# EAGLE design badge (EAGLE 5.10)
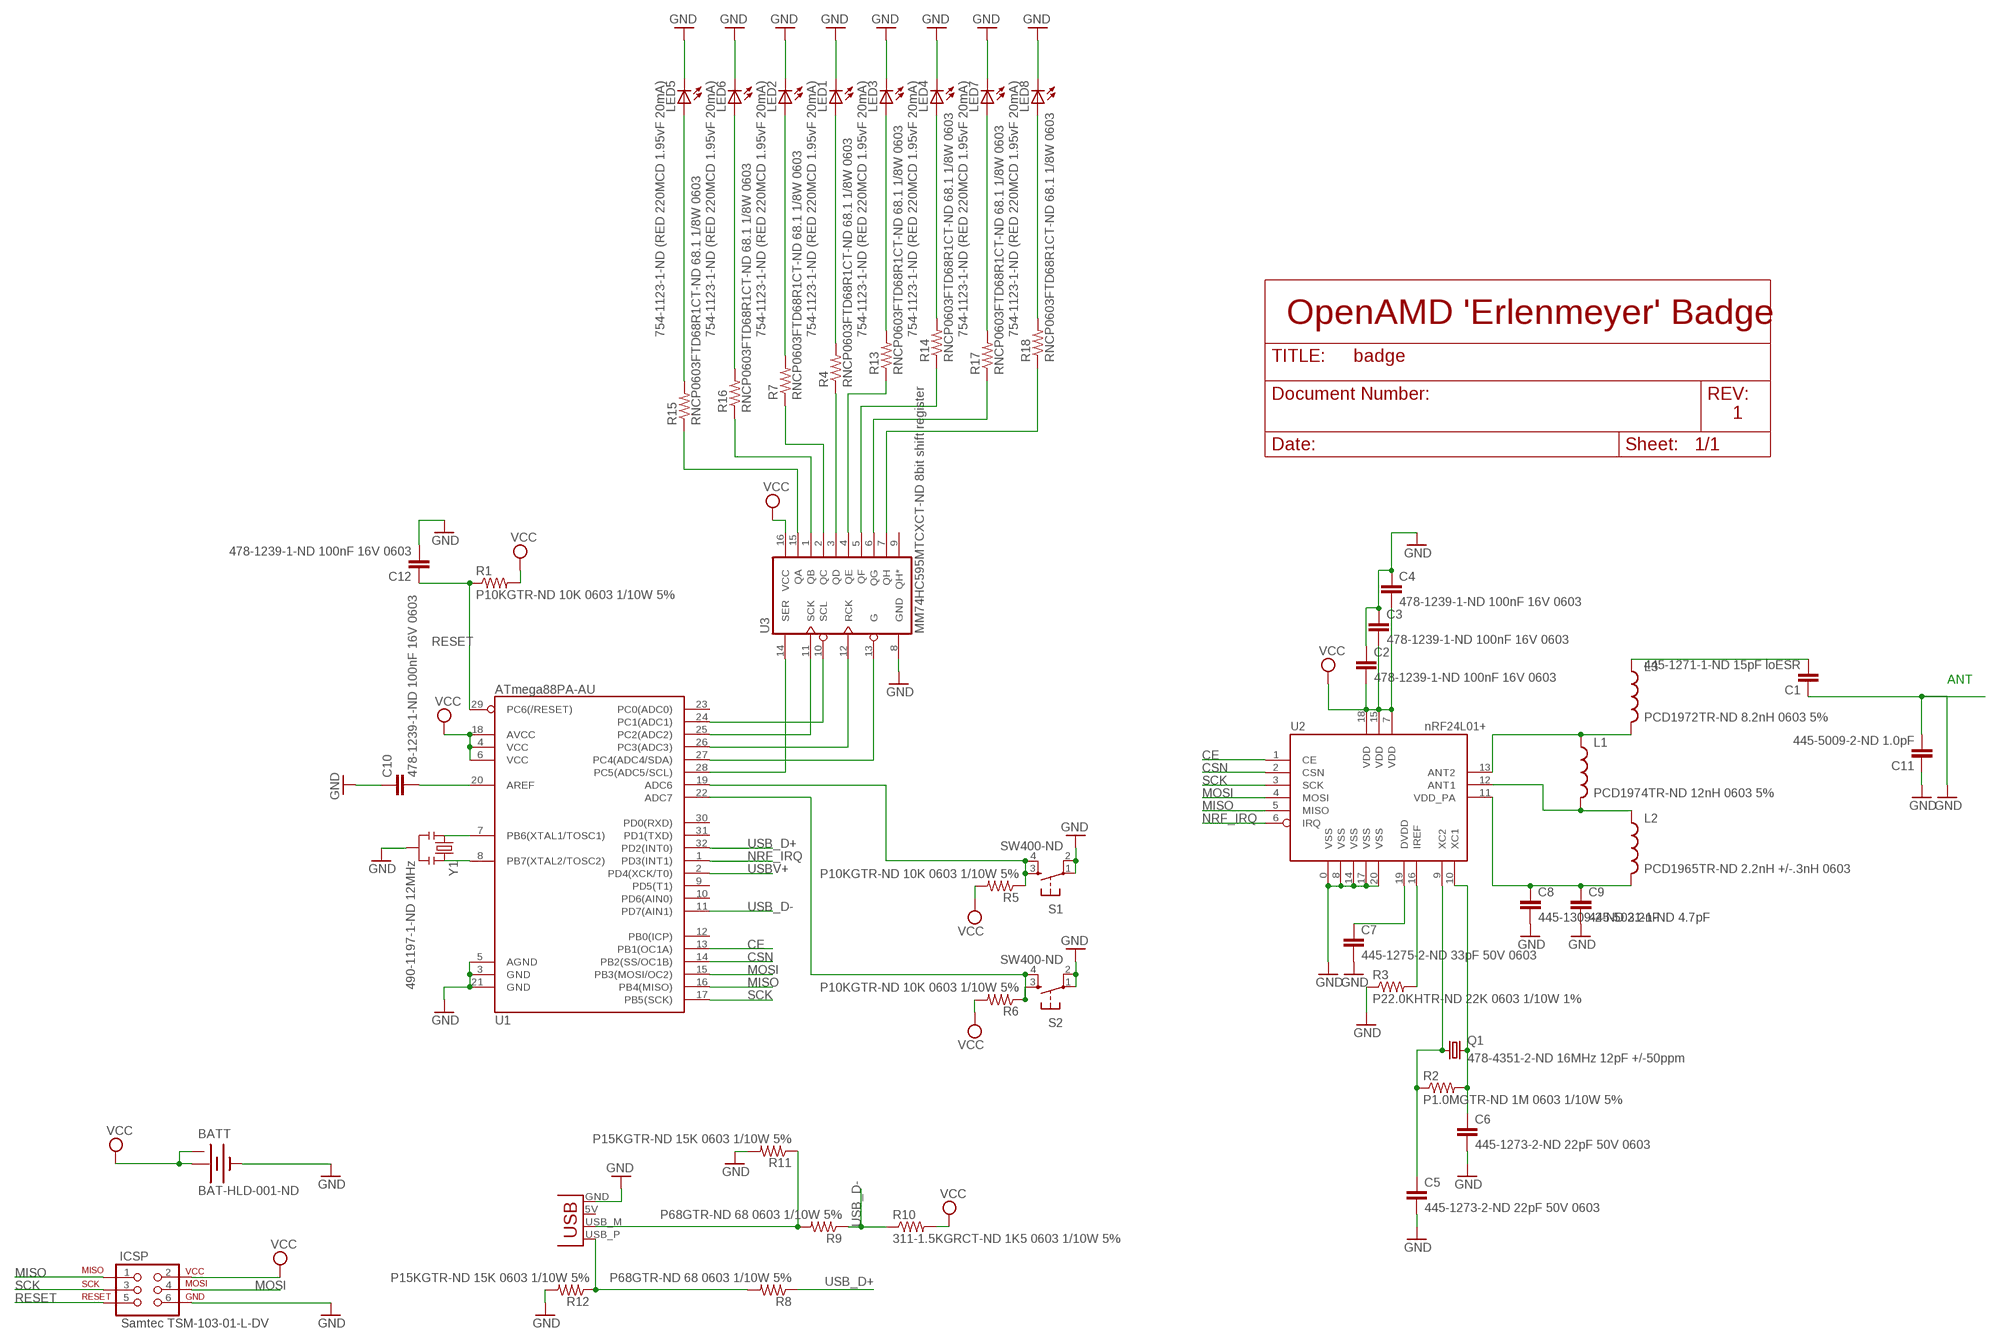
[diagram p0: schematic, sheet 1]

## Parts
BATT  BAT-HLD-001-ND  BATTERY20SMD  [BATTCON_20MM]
C1  445-1271-1-ND 15pF loESR  CAP0603-CAP  [0603-CAP]
C2  478-1239-1-ND 100nF 16V 0603  CAP0603-CAP  [0603-CAP]
C3  478-1239-1-ND 100nF 16V 0603  CAP0603-CAP  [0603-CAP]
C4  478-1239-1-ND 100nF 16V 0603  CAP0603-CAP  [0603-CAP]
C5  445-1273-2-ND 22pF 50V 0603  CAP0603-CAP  [0603-CAP]
C6  445-1273-2-ND 22pF 50V 0603  CAP0603-CAP  [0603-CAP]
C7  445-1275-2-ND 33pF 50V 0603  CAP0603-CAP  [0603-CAP]
C8  445-1309-2-ND 2.2nF  CAP0603-CAP  [0603-CAP]
C9  445-5031-1-ND 4.7pF  CAP0603-CAP  [0603-CAP]
C10  478-1239-1-ND 100nF 16V 0603  CAP0603-CAP  [0603-CAP]
C11  445-5009-2-ND 1.0pF  CAP0603-CAP  [0603-CAP]
C12  478-1239-1-ND 100nF 16V 0603  CAP0603-CAP  [0603-CAP]
ICSP  Samtec TSM-103-01-L-DV  SMT_AVR_PROGRAMMER  [2X5-SHROUDED_SMD]
L1  PCD1974TR-ND 12nH 0603 5%  INDUCTOR0603  [0603]
L2  PCD1965TR-ND 2.2nH +/-.3nH 0603  INDUCTOR0603  [0603]
L3  PCD1972TR-ND 8.2nH 0603 5%  INDUCTOR0603  [0603]
LED1  754-1123-1-ND (RED 220MCD 1.95vF 20mA)  LED0603  [LED-0603]
LED2  754-1123-1-ND (RED 220MCD 1.95vF 20mA)  LED0603  [LED-0603]
LED3  754-1123-1-ND (RED 220MCD 1.95vF 20mA)  LED0603  [LED-0603]
LED4  754-1123-1-ND (RED 220MCD 1.95vF 20mA)  LED0603  [LED-0603]
LED5  754-1123-1-ND (RED 220MCD 1.95vF 20mA)  LED0603  [LED-0603]
LED6  754-1123-1-ND (RED 220MCD 1.95vF 20mA)  LED0603  [LED-0603]
LED7  754-1123-1-ND (RED 220MCD 1.95vF 20mA)  LED0603  [LED-0603]
LED8  754-1123-1-ND (RED 220MCD 1.95vF 20mA)  LED0603  [LED-0603]
Q1  478-4351-2-ND 16MHz 12pF +/-50ppm  CRYSTALSMD  [HC49UP]
R1  P10KGTR-ND 10K 0603 1/10W 5%  RESISTOR0603-RES  [0603-RES]
R2  P1.0MGTR-ND 1M 0603 1/10W 5%  RESISTOR0603-RES  [0603-RES]
R3  P22.0KHTR-ND 22K 0603 1/10W 1%  RESISTOR0603-RES  [0603-RES]
R4  RNCP0603FTD68R1CT-ND 68.1 1/8W 0603  RESISTOR0603-RES  [0603-RES]
R5  P10KGTR-ND 10K 0603 1/10W 5%  RESISTOR0603-RES  [0603-RES]
R6  P10KGTR-ND 10K 0603 1/10W 5%  RESISTOR0603-RES  [0603-RES]
R7  RNCP0603FTD68R1CT-ND 68.1 1/8W 0603  RESISTOR0603-RES  [0603-RES]
R8  P68GTR-ND 68 0603 1/10W 5%  RESISTOR0603-RES  [0603-RES]
R9  P68GTR-ND 68 0603 1/10W 5%  RESISTOR0603-RES  [0603-RES]
R10  311-1.5KGRCT-ND 1K5 0603 1/10W 5%  RESISTOR0603-RES  [0603-RES]
R11  P15KGTR-ND 15K 0603 1/10W 5%  RESISTOR0603-RES  [0603-RES]
R12  P15KGTR-ND 15K 0603 1/10W 5%  RESISTOR0603-RES  [0603-RES]
R13  RNCP0603FTD68R1CT-ND 68.1 1/8W 0603  RESISTOR0603-RES  [0603-RES]
R14  RNCP0603FTD68R1CT-ND 68.1 1/8W 0603  RESISTOR0603-RES  [0603-RES]
R15  RNCP0603FTD68R1CT-ND 68.1 1/8W 0603  RESISTOR0603-RES  [0603-RES]
R16  RNCP0603FTD68R1CT-ND 68.1 1/8W 0603  RESISTOR0603-RES  [0603-RES]
R17  RNCP0603FTD68R1CT-ND 68.1 1/8W 0603  RESISTOR0603-RES  [0603-RES]
R18  RNCP0603FTD68R1CT-ND 68.1 1/8W 0603  RESISTOR0603-RES  [0603-RES]
S1  SW400-ND  TAC_SWITCHSMD  [TACTILE_SWITCH_SMD]
S2  SW400-ND  TAC_SWITCHSMD  [TACTILE_SWITCH_SMD]
U1  ATmega88PA-AU  ATMEGA168  [TQFP32-08]
U2  nRF24L01+  NRF24L01SMD  [QFN20]
U3  MM74HC595MTCXCT-ND 8bit shift register  74595  [TSSOP16]
X2  USBPCB  [USB-A-PCB]
Y1  490-1197-1-ND 12MHz  RESONATORSMD  [RESONATOR-SMD]

## Nets
CE: U1.13(PB1(OC1A)) U2.1(CE)
CSN: U1.14(PB2(SS/OC1B)) U2.2(CSN)
GND: BATT.2(-) C1.1 C2.1 C3.1 C4.1 C5.2 C6.2 C7.2 C8.2 C9.2 C10.1 C11.1 C11.2 C12.2 ICSP.6 LED1.C LED2.C LED3.C LED4.C LED5.C LED6.C LED7.C LED8.C R3.1 R11.2 R12.2 S1.1 S1.2 S2.1 S2.2 U1.3(GND) U1.5(AGND) U1.21(GND) U2.0(VSS) U2.8(VSS) U2.14(VSS) U2.17(VSS) U2.20(VSS) U3.8(GND) X2.GND Y1.2
MISO: ICSP.1 U1.16(PB4(MISO)) U2.5(MISO)
MOSI: ICSP.4 U1.15(PB3(MOSI/OC2)) U2.4(MOSI)
N$1: L1.1 L3.2 U2.13(ANT2)
N$2: L1.2 L2.1 U2.12(ANT1)
N$3: C8.1 C9.1 L2.2 U2.11(VDD_PA)
N$4: R5.1 S1.3 S1.4 U1.19(ADC6)
N$5: R6.1 S2.3 S2.4 U1.22(ADC7)
N$6: R3.2 U2.16(IREF)
N$7: C1.2 L3.1
N$8: C5.1 Q1.1 R2.1 U2.9(XC2)
N$9: C6.1 Q1.2 R2.2 U2.10(XC1)
N$10: C7.1 U2.19(DVDD)
N$11: R9.2 R11.1 X2.USB_M(D-)
N$12: LED2.A R7.2
N$13: LED1.A R4.2
N$14: U1.7(PB6(XTAL1/TOSC1)) Y1.1
N$15: U1.24(PC1(ADC1)) U3.10(SCL)
N$16: U1.26(PC3(ADC3)) U3.12(RCK)
N$17: U1.8(PB7(XTAL2/TOSC2)) Y1.3
N$18: R8.2 R12.1 X2.USB_P(D+)
N$19: LED3.A R13.2
N$20: U1.27(PC4(ADC4/SDA)) U3.13(G)
N$21: LED4.A R14.2
N$23: LED5.A R15.2
N$24: U1.28(PC5(ADC5/SCL)) U3.14(SER)
N$25: LED6.A R16.2
N$26: U1.25(PC2(ADC2)) U3.11(SCK)
N$32: C10.2 U1.20(AREF)
N$33: R15.1 U3.15(QA)
N$34: R16.1 U3.1(QB)
N$35: R7.1 U3.2(QC)
N$36: R4.1 U3.3(QD)
N$37: R13.1 U3.4(QE)
N$38: R14.1 U3.5(QF)
N$39: LED7.A R17.2
N$40: LED8.A R18.2
N$41: R18.1 U3.7(QH)
N$42: R17.1 U3.6(QG)
NRF_IRQ: U1.1(PD3(INT1)) U2.6(IRQ)
RESET: C12.1 ICSP.5 R1.1 U1.29(PC6(/RESET))
SCK: ICSP.3 U1.17(PB5(SCK)) U2.3(SCK)
USB_D+: R8.1 U1.32(PD2(INT0))
USB_D-: R9.1 R10.1 U1.11(PD7(AIN1))
USBV+: U1.2(PD4(XCK/T0))
VCC: BATT.1(+) BATT.3(+1) C2.2 C3.2 C4.2 ICSP.2 R1.2 R5.2 R6.2 R10.2 U1.4(VCC) U1.6(VCC) U1.18(AVCC) U2.7(VDD) U2.15(VDD) U2.18(VDD) U3.16(VCC)
Unconnected: U1.9(PD5(T1)) U1.10(PD6(AIN0)) U1.12(PB0(ICP)) U1.23(PC0(ADC0)) U1.30(PD0(RXD)) U1.31(PD1(TXD)) U3.9(QH*) X2.5V(VBUS)

## Notes on the sheet
- OpenAMD 'Erlenmeyer' Badge
- 1
- ANT

## Library data of the parts
BATT = cccamd:BATTERY: Battery Holders Various common sizes : AA, AAA, 20mm coin cell and 12mm coin cell.
C1-C12 = SparkFun:CAP: Capacitor Standard 0603 ceramic capacitor, and 0.1" leaded capacitor.
ICSP = cccamd:SMT_AVR_PROGRAMMER
L1-L3 = SparkFun:INDUCTOR: Inductors Basic Inductor/Choke - 0603 and 1206. Footprints are not proven and vary greatly between part numbers.
LED1-LED8 = SparkFun:LED: LEDs Standard schematic elements and footprints for 5mm, 3mm, 1206, and 0603 sized LEDs. 5mm - Spark Fun Electronics SKU : COM-00529 (and others)
Q1 = SparkFun:CRYSTAL: Crystals Various standard crystals. Proven footprints. Spark Fun Electronics SKU : COM-00534
R1-R18 = SparkFun:RESISTOR: Resistor Basic schematic elements and footprints for 0603, 1206, and PTH resistors.
S1 S2 = SparkFun:TAC_SWITCH: Momentary Switch Button commonly used for reset or general input. Spark Fun Electronics SKU : COM-00097
U1 = SparkFun:ATMEGA168
U2 = SparkFun:NRF24L01: 2.4GHz Low Power Transceiver This is the very popular, low cost, very low power RF transceiver from Nordic Semiconductor. Simple SPI interface. SKU: COM-00690
U3 = SparkFun:74*595: 8-bit SHIFT REGISTER, output latch
X2 = SparkFun:USB: USB Connectors USB-B-PTH is fully proven SKU : PRT-00139 USB-miniB is fully proven SKU : PRT-00587 USB-A-PCB is untested. USB-A-H is throughly reviewed, but untested. Spark Fun Electronics SKU : PRT-00437 USB-B-SMT is throughly reviewed, but untested. Needs silkscreen touching up. USB-A-S has not been used/tested USB-MB-H has not been used/tested
Y1 = SparkFun:RESONATOR: Resonator Small SMD resonator. This is the itty bitty 10/20MHz resonators with built in caps. CSTCE10M0G55 and CSTCE20M0V53. Footprint has been reviewed closely but hasn't been tested yet.

## Board
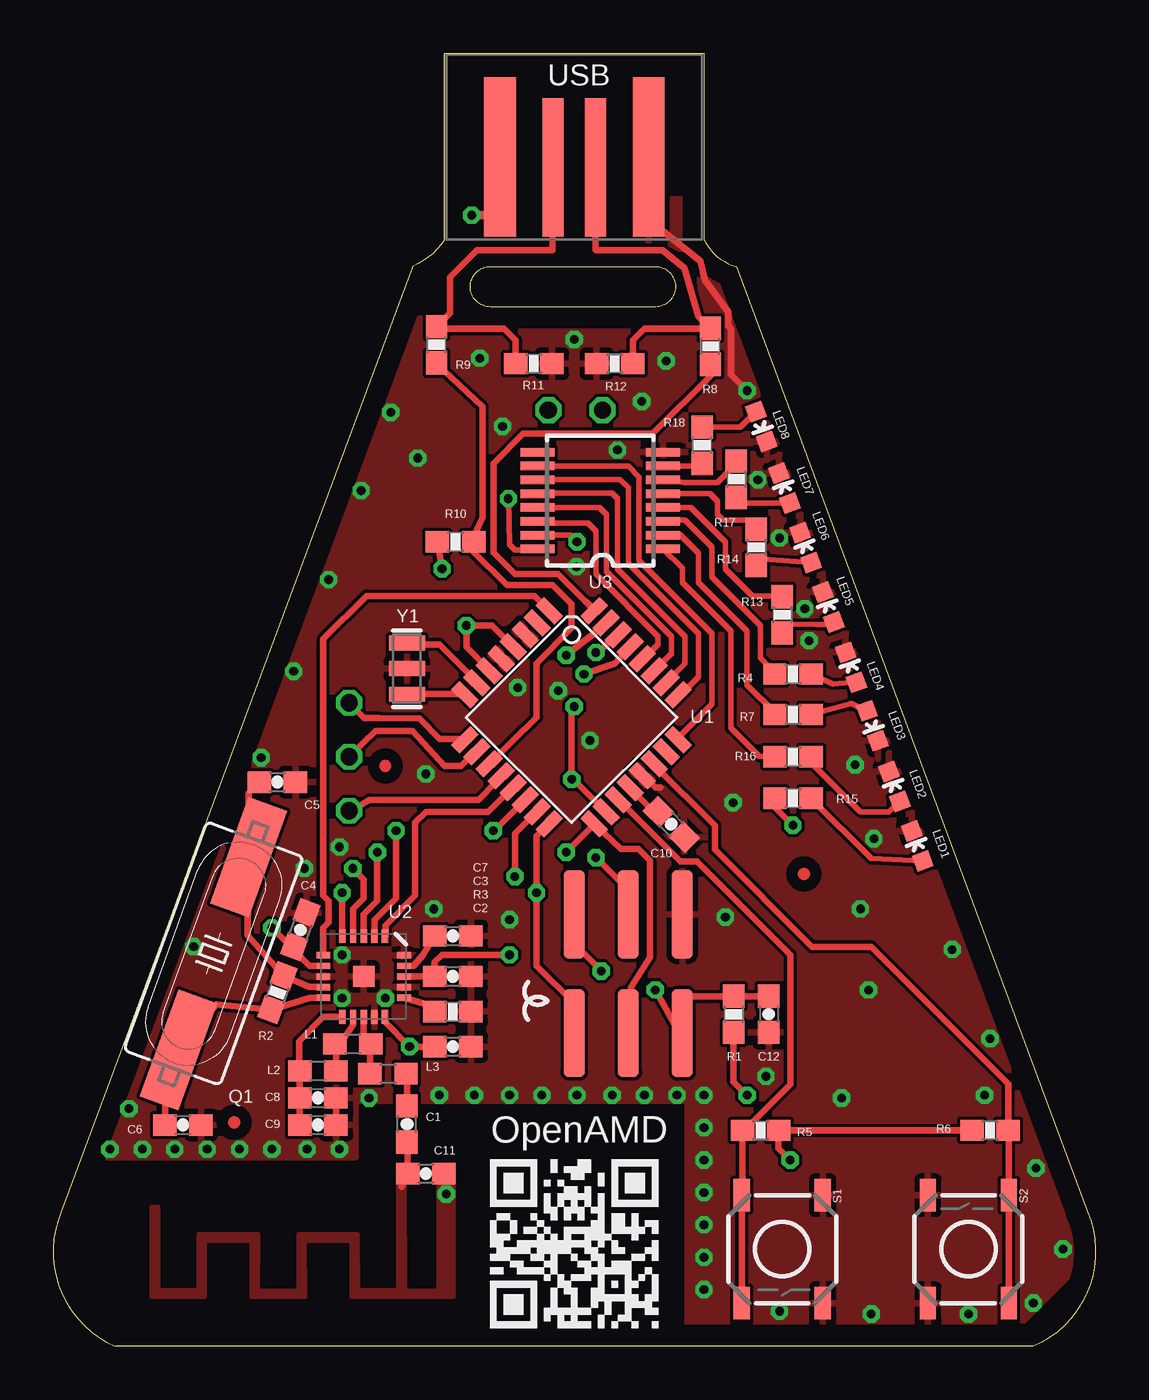
[diagram p1: board, top side]
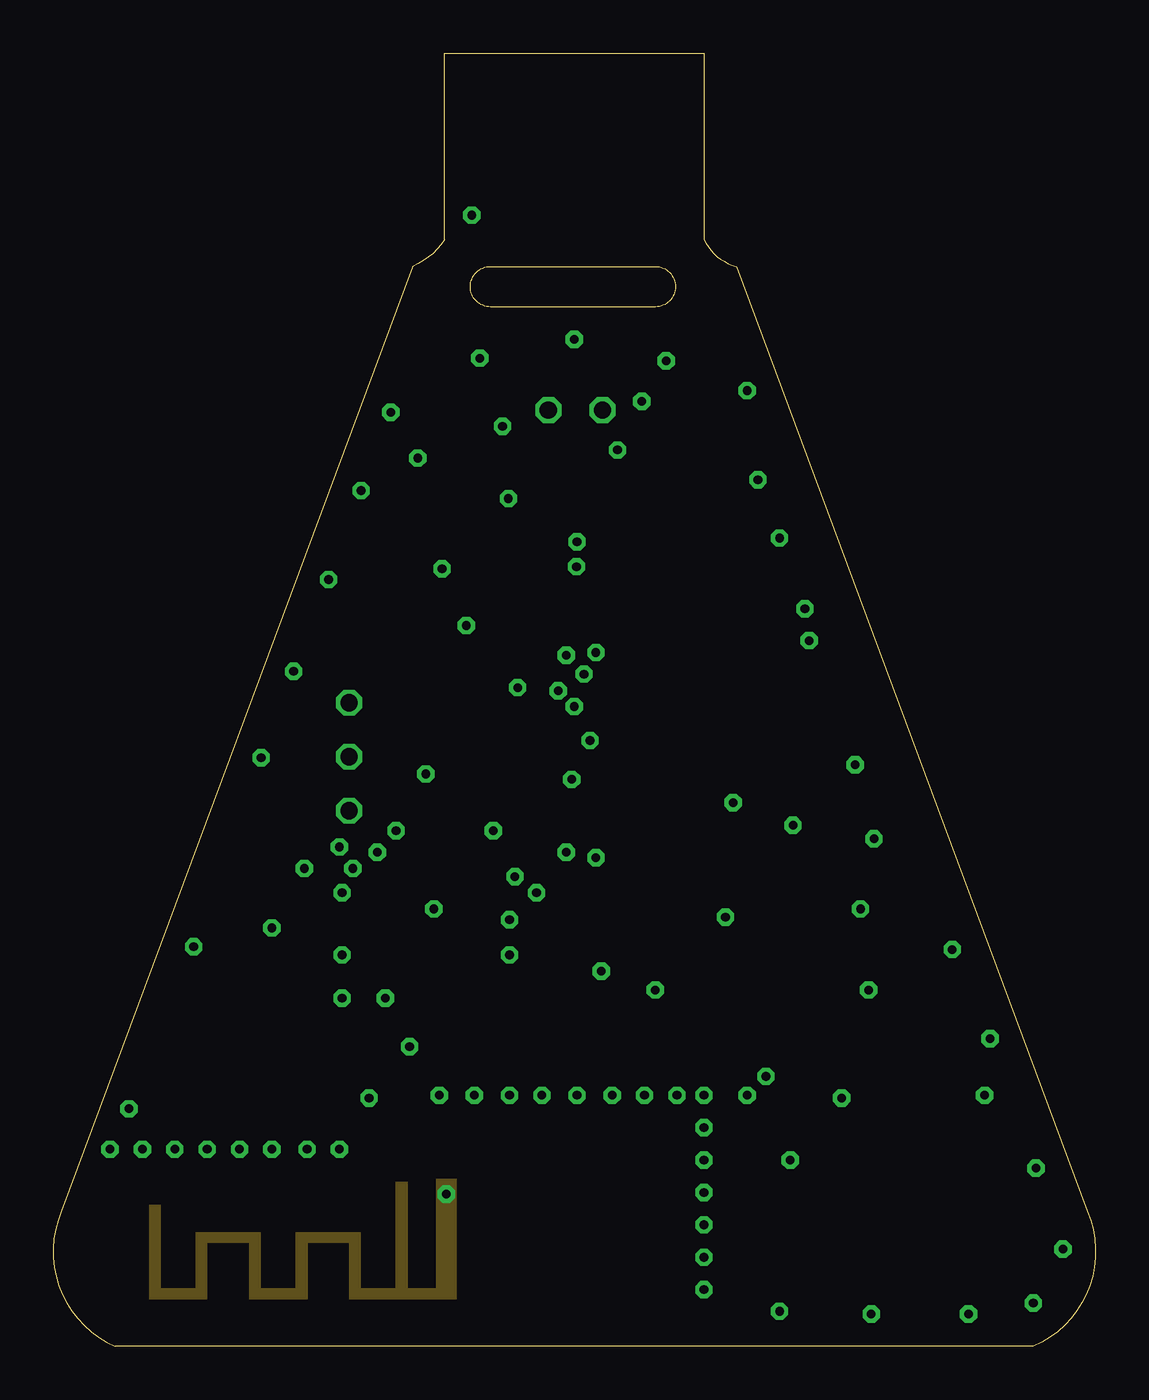
[diagram p2: board, inner layer NotUsed]
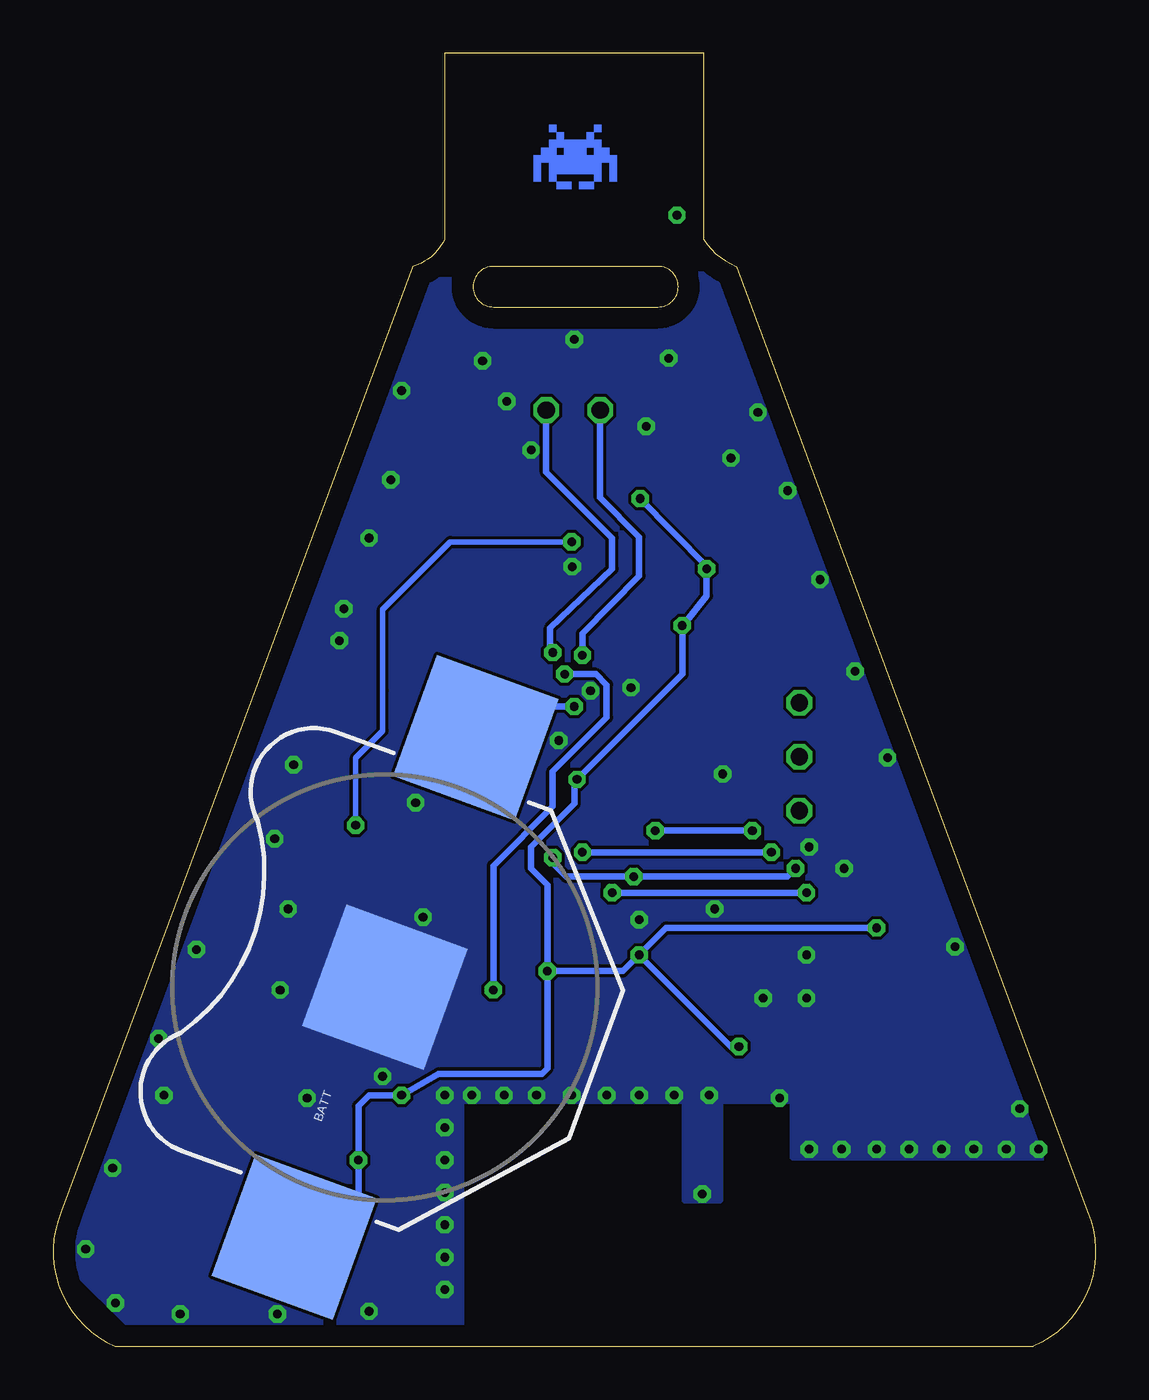
[diagram p3: board, bottom side, seen from below]

Size 49.04 x 60.83 mm. Coordinates in mm from the lower left corner, seen from the top.
Outline: 28.33,50.8 arc-180 28.33,48.9 20.58,48.9 arc-180 20.58,50.8 28.33,50.8
Outline: 18.42,52.07 18.42,60.83 30.61,60.83 30.61,52.07 arc49 32.14,50.8 48.65,6.35 arc-90 46.11,0 2.93,0 arc-90 0.39,6.35 16.9,50.8 arc36 18.42,52.07
Copper layers (1*16): Top 0.035mm / dielectric 1.5mm / Bottom 0.035mm
Design rules "default *": minimum track width 10mil, minimum drill 24mil, track to track 6mil, track to pad 6mil, pad to pad 6mil, via to via 8mil, smd to smd 6mil, copper to edge 40mil, drill to drill 8mil, minimum pad ring 10mil, minimum via ring 8mil, stop-mask expansion 4mil, vias tented up to drill 20mil, thermal gap 10mil
tRestrict: area 15.1,26.7 to 16.2,27.9; area 7.9,10 to 9.1,11.1; area 34.7,21.7 to 35.9,22.8

### Footprints (pad centres in the part's own frame; a part is rotated, then mirrored left to right if it is on the bottom)
BATTCON_20MM = smd 6.07 x 6.07: 1 -12.5,0; 2 0,0; 3 12.5,0
0603-CAP = smd 1.1 x 1: 1 -0.85,0; 2 0.85,0
2X5-SHROUDED_SMD = smd 4.15 x 1: 1 -2.794,2.54; 2 2.794,2.54; 3 -2.794,0; 4 2.794,0; 5 -2.794,-2.54; 6 2.794,-2.54
0603 = smd 1.1 x 1: 1 -0.85,0; 2 0.85,0
LED-0603 = smd 0.8 x 0.8: A 0,-0.75; C 0,0.75
HC49UP = smd 5.334 x 1.93: 1 -4.826,0; 2 4.826,0
0603-RES = smd 1.1 x 1: 1 -0.85,0; 2 0.85,0
TACTILE_SWITCH_SMD = smd 1.524 x 0.762: 1 -2.54,1.905; 2 2.54,1.905; 3 -2.54,-1.905; 4 2.54,-1.905
TQFP32-08 = smd 1.27 x 0.559: 1 -4.293,2.8; 2 -4.293,2; 3 -4.293,1.2; 4 -4.293,0.4; 5 -4.293,-0.4; 6 -4.293,-1.2; 7 -4.293,-2; 8 -4.293,-2.8; 17 4.293,-2.8; 18 4.293,-2; 19 4.293,-1.2; 20 4.293,-0.4; 21 4.293,0.4; 22 4.293,1.2; 23 4.293,2; 24 4.293,2.8 | smd 0.559 x 1.27: 9 -2.8,-4.293; 10 -2,-4.293; 11 -1.2,-4.293; 12 -0.4,-4.293; 13 0.4,-4.293; 14 1.2,-4.293; 15 2,-4.293; 16 2.8,-4.293; 25 2.8,4.293; 26 2,4.293; 27 1.2,4.293; 28 0.4,4.293; 29 -0.4,4.293; 30 -1.2,4.293; 31 -2,4.293; 32 -2.8,4.293
QFN20 = smd 1 x 1: 0 0,0 | smd 0.65 x 0.3: 1 -1.9,1; 2 -1.9,0.5; 3 -1.9,0; 4 -1.9,-0.5; 5 -1.9,-1; 11 1.9,-1; 12 1.9,-0.5; 13 1.9,0; 14 1.9,0.5; 15 1.9,1 | smd 0.3 x 0.65: 6 -1,-1.9; 7 -0.5,-1.9; 8 0,-1.9; 9 0.5,-1.9; 10 1,-1.9; 16 1,1.9; 17 0.5,1.9; 18 0,1.9; 19 -0.5,1.9; 20 -1,1.9
TSSOP16 = smd 0.4 x 1.6: 1 -2.225,-2.85; 2 -1.575,-2.85; 3 -0.925,-2.85; 4 -0.275,-2.85; 5 0.375,-2.85; 6 1.025,-2.85; 7 1.675,-2.85; 8 2.325,-2.85; 9 2.325,3.05; 10 1.675,3.05; 11 1.025,3.05; 12 0.375,3.05; 13 -0.275,3.05; 14 -0.925,3.05; 15 -1.575,3.05; 16 -2.225,3.05
USB-A-PCB = smd 7.5 x 1.5: 5V -0.2,-3.5; GND -0.2,3.5 | smd 6.5 x 1: USB_M 0.3,-1; USB_P 0.3,1
RESONATOR-SMD = smd 0.7 x 1.7: 1 -1.2,0; 2 0,0; 3 1.2,0

### Placement (x,y rotation side)
BATT  33.42,16.89 70 bottom
C1  16.64,10.46 90 top
C2  18.8,14.1 180 top
C3  18.8,17.4 180 top
C4  11.63,19.6 250 top
C5  10.55,26.54 0 top
C6  6.1,10.41 0 top
C7  18.8,19.3 0 top
C8  12.45,11.68 0 top
C9  12.45,10.41 0 top
C10  29.08,24.56 135 top
C11  17.53,8.13 180 top
C12  33.66,15.62 270 top
ICSP  27.06,17.53 90 top
L1  14.1,14.22 180 top
L2  12.45,12.95 180 top
L3  15.76,12.83 180 top
LED1  37.54,31.95 20 top
LED2  38.54,29.19 200 top
LED3  36.47,34.78 20 top
LED4  35.4,37.58 20 top
LED5  40.65,23.54 20 top
LED6  39.57,26.34 20 top
LED7  34.4,40.37 20 top
LED8  33.31,43.27 200 top
Q1  7.54,18.48 250 top
R1  32.01,15.62 270 top
R2  10.55,16.64 250 top
R3  18.8,15.75 180 top
R4  34.81,31.62 0 top
R5  33.28,10.16 0 top
R6  44.08,10.16 180 top
R7  34.81,29.72 0 top
R8  30.92,47.04 90 top
R9  18.04,47.12 90 top
R10  18.93,37.85 180 top
R11  22.61,46.23 0 top
R12  26.42,46.23 180 top
R13  34.3,34.42 270 top
R14  33.08,37.59 270 top
R15  34.81,25.78 0 top
R16  34.81,27.74 0 top
R17  32.14,40.79 270 top
R18  30.54,42.39 90 top
S1  34.3,4.57 270 top
S2  43.06,4.57 90 top
U1  24.39,29.59 315 top
U2  14.61,17.4 270 top
U3  25.84,39.73 90 top
X2  24.52,55.75 270 top
Y1  16.64,31.88 270 top

### Tracks (layer width: path | path; a pad name or v marks a point on that pad's centre or on a via)
CE
  Top 0.305: U1.13 21.58,26.27 20.45,25.15 17.53,25.15 17.03,24.64 17.03,21.21 15.63,19.81 15.63,19.32 U2.1
CSN  (via drill 0.41)
  Top 0.305: 22.16,25.71 U1.14 20.75,24.26 v20.71,24.26 | U2.2 15.11,20.06 16.14,21.08 v16.14,24.26
  Bottom 0.305: v16.14,24.26 v20.71,24.26
GND  (via drill 0.41)
  Top 0.305: C11.1 18.51,8.13 | C1.1 16.68,9.44 C11.2 16.64,8.13 16.39,7.49 | C9.2 C8.2 | X2.GND 28.32,52.76 30.45,51.05 30.65,50.15 31.76,48.64 31.76,48.01 31.88,47.88 31.88,45.72 v32.65,44.96 | 28.58,26.29 28.33,26.29 28.07,26.54 28.01,26.54 U1.21
  other vias: 18.5,7.16 26.3,11.81 27.82,11.81 8.77,9.27 7.25,9.27 5.72,9.27 4.2,9.27 2.67,9.27 3.56,11.18 38.36,16.76 6.61,18.8 37.98,20.57 9.79,27.69 11.31,31.75 12.96,36.07 14.49,40.26 15.88,43.94 20.07,46.48 21.14,43.28 27.69,44.45 28.84,46.36 24.52,47.37 13.6,16.38 13.6,18.41 15.63,16.38 17.91,20.57 19.82,11.81 24.65,11.81 21.85,30.99 37.09,11.68 26.55,42.16 38.62,23.88 42.3,18.67 44.08,14.48 46.24,8.38 47.51,4.57 46.11,2.03 30.61,2.67 30.61,4.19 30.61,5.71 30.61,7.24 30.61,8.76 30.61,10.29 29.34,11.81 37.73,27.36 35.57,33.2 31.99,25.58 35.36,34.7 34.17,38.02 31.63,20.19 21.47,20.07 43.82,11.81 17.15,41.78 34.17,1.65 43.06,1.52 38.49,1.52 33.15,40.77 11.82,22.48 17.53,26.92 13.47,23.5 21.47,11.81 22.99,11.81 18.17,11.81 10.29,9.27 33.54,12.7 11.95,9.27 13.47,9.27 14.87,11.68 30.61,11.81 24.62,36.68 25.25,28.5 23.76,30.84
  pour Top (no thermals): 16.54,7.75 16.56,2.62 18.14,2.63 18.14,7.92 18.84,7.87 18.84,2.32 14.04,2.32 14.05,4.97 11.84,4.97 11.84,2.32 9.34,2.33 9.35,4.97 7.13,4.97 7.13,2.32 4.64,2.32 4.64,6.57 4.93,6.57 4.93,2.63 6.84,2.64 6.84,5.27 9.63,5.27 9.63,2.62 11.54,2.64 11.54,5.27 14.33,5.27 14.34,2.63 16.23,2.63 16.24,7.75
  pour Top (isolate 0.102): 1.66,8.89 14.23,8.89 14.23,11.56 29.85,11.56 29.85,0.64 45.09,0.64 48.39,3.94 31.88,50.17 30.11,50.17 30.11,53.98 27.31,53.98 27.31,51.56 18.8,51.56 17.28,50.04
  pour Bottom (no thermals): 1.66,8.89 14.23,8.89 14.23,11.56 17.66,11.56 17.66,6.86 19.31,6.86 19.31,11.56 29.85,11.56 29.85,0.64 45.09,0.64 48.39,3.94 31.88,50.17 30.11,50.17 30.11,53.98 27.31,53.98 27.31,51.56 18.8,51.56 17.28,50.04
  pour NotUsed (no thermals): 16.64,7.75 16.64,2.73 18.04,2.73 18.04,7.87 18.94,7.87 18.94,2.22 13.94,2.22 13.94,4.86 11.95,4.86 11.95,2.22 9.24,2.22 9.24,4.86 7.23,4.86 7.23,2.22 4.54,2.22 4.54,6.67 5.04,6.67 5.04,2.73 6.74,2.73 6.74,5.37 9.74,5.37 9.74,2.73 11.44,2.73 11.44,5.37 14.43,5.37 14.43,2.73 16.14,2.73 16.14,7.75
MISO  (via drill 0.41)
  Top 0.305: U1.16 23.31,24.58 22.74,24 v22.74,21.34 22.74,17.91 24.52,16.13 ICSP.1 | v13.6,21.34 13.6,19.32 U2.5
  Bottom 0.305: v13.6,21.34 v22.74,21.34
MOSI  (via drill 0.41)
  Top 0.305: U1.15 22.74,25.14 21.72,24.13 v21.72,22.1 | v14.1,22.48 14.61,21.97 14.61,21.08 14.1,20.57 U2.4 | ICSP.4 27.06,21.46 v25.53,22.99
  Bottom 0.305: v14.1,22.48 14.49,22.1 v21.72,22.1 24.9,22.1 25.53,22.73 v25.53,22.99
N$1
  Top 0.305: U2.13 14.61,14.1 L1.1 14.91,13.72 L3.2
N$2
  Top 0.305: U2.12 14.1,15.11 13.25,13.88 L1.2 13.3,13.67 L2.1
N$3
  Top 0.305: U2.11 12.71,15.5 11.56,14.35 11.56,12.48 L2.2 C8.1 C9.1
N$4
  Top 0.305: U1.19 26.62,25.71 29.52,22.81 30.28,22.81 34.68,18.41 34.68,12.32 32.65,10.29 32.77,10.5 R5.1 32.43,7.15 S1.3 S1.4
N$5
  Top 0.305: U1.22 28.28,27.36 31.12,24.51 31.12,23.37 35.69,18.8 38.49,18.8 44.93,12.36 R6.1 44.97,10.12 S2.4 S2.3
N$6
  Top 0.305: R3.2 17.79,16 17.41,16.13 16.53,16.38 U2.16
N$7
  Top 0.305: L3.1 16.64,12.45 C1.2
N$8
  Top 0.305: U2.9 12.05,16.9 R2.1 9.16,19.34 Q1.1 9.19,26.02 9.19,26.04 C5.1
N$9
  Top 0.305: U2.10 12.07,16.4 R2.2 7.66,16.09 Q1.2 5.3,12 C6.1
N$10
  Top 0.305: U2.19 16.96,17.9 17.41,18.41 C7.1
N$11
  Top 0.305: X2.USB_M 23.5,55.44 23.5,51.56 19.95,51.56 18.68,50.29 18.68,48.6 R9.2 18.13,47.88 21.22,47.88 21.76,47.33 R11.1
N$12
  Top 0.254: R7.2 37.56,30.23 LED2.A
N$13
  Top 0.254: R4.2 36.67,31.16 LED1.A
N$14
  Top 0.305: U1.7 19.94,31.25 18.17,33.02 16.7,33.02 Y1.1
N$15
  Top 0.254: U3.10 27.06,41.4 27.57,40.89 27.57,36.96 31,33.53 31,30.23 29.41,28.64 U1.24
N$16
  Top 0.254: U3.12 22.81,40.13 26.3,40.13 26.55,39.88 26.55,36.58 29.73,33.4 29.73,32.13 28.84,31.25 U1.26
N$17
  Top 0.305: Y1.3 19.35,30.68 U1.8
N$18
  Top 0.305: X2.USB_P 25.52,51.58 25.53,51.56 28.67,51.56 29.7,50.72 30.36,48.45 R8.2 30.91,47.88 27.82,47.88 27.27,47.33 R12.1
N$19
  Top 0.254: R13.2 34.7,33.97 35.9,33.96 36.62,33.96 LED3.A
N$20
  Top 0.254: U1.27 29.09,32.59 29.09,33.4 26.04,36.45 26.04,39.12 25.7,39.46 U3.13
N$21
  Top 0.254: R14.2 33.36,37.03 LED4.A
N$22  (via drill 0.41)
  Top 0.406: v19.69,53.21 20.96,53.21
N$23
  Top 0.254: R15.2 38.5,22.94 LED5.A
N$24
  Top 0.254: U3.14 22.86,38.74 25.15,38.74 25.53,38.35 25.53,36.32 28.46,33.4 28.46,33.02 27.78,32.34 U1.28
N$25
  Top 0.254: LED6.A 39.32,25.15 37.98,25.15 35.66,27.47 R16.2
N$26
  Top 0.254: U3.11 26.68,40.77 27.06,40.39 27.06,36.83 30.36,33.53 30.36,31.5 29.51,30.65 U1.25
N$27  (via drill 0.81)
  Top 0.305: 19.31,28.57 18.17,28.57 17.23,29.54 15.3,29.57 14.64,29.57 v13.93,30.28
N$28  (via drill 0.81)
  Top 0.305: 19.69,27.81 19.18,27.3 18.42,27.3 16.9,28.96 15.17,28.96 v13.93,27.74
N$29  (via drill 0.81)
  Top 0.305: 20.84,26.54 20.02,25.7 14.87,25.7 14.49,25.48 v13.93,25.2
N$30  (via drill 0.41, 0.81)
  Top 0.305: 25.92,34.04 26.04,34.04 25.33,33.43 v24.14,32.51
  Bottom 0.305: v24.14,32.51 24.14,33.53 21.47,36.25 21.47,38.08 23.3,39.93 v23.3,44.04
N$31  (via drill 0.41, 0.81)
  Top 0.305: 26.55,33.4 26.55,33.53 25.92,32.89 v25.53,32.64
  Bottom 0.305: v25.53,32.64 25.66,32.77 25.66,33.78 22.74,36.58 22.74,38.02 25.84,41.12 v25.84,44.04
N$32
  Top 0.305: U1.20 28.16,25.26 C10.2
N$33  (via drill 0.41)
  Top 0.254: U3.15 24.33,38.16 v24.65,37.85 | v34.81,24.51 33.96,25.36 R15.1
  Bottom 0.254: v24.65,37.85 30.36,37.85 33.54,34.67 33.54,30.86 33.54,28.96 34.81,27.69 v34.81,24.51
N$34
  Top 0.254: U3.1 29.6,36.6 29.6,35.94 31.88,33.66 31.88,29.08 33.23,27.74 R16.1
N$35
  Top 0.254: U3.2 28.75,38.1 29.47,38.2 30.36,37.31 30.36,35.94 32.65,33.66 32.65,31.11 33.96,29.81 R7.1
N$36
  Top 0.254: U3.3 28.74,38.86 29.73,38.86 31,37.59 31,36.2 33.28,33.91 33.28,32.39 33.96,31.71 R4.1
N$37
  Top 0.254: U3.4 30.02,39.46 31.63,37.85 31.63,36.58 32.9,35.31 34.26,35.31 R13.1
N$38
  Top 0.254: U3.5 30.89,40.11 31.25,39.75 31.25,39.12 31.5,38.86 32.66,38.86 R14.1
N$39
  Top 0.254: R17.2 32.41,39.67 LED7.A
N$40
  Top 0.254: R18.2 32.32,43.24 LED8.A
N$41
  Top 0.254: U3.7 30.41,41.41 R18.1
N$42
  Top 0.254: R17.1 32.14,41.53 31.25,40.64 29.73,40.64 U3.6
NRF_IRQ
  Top 0.305: U2.6 12.71,19.69 12.96,19.94 12.96,20.95 12.71,21.21 12.71,33.28 14.74,35.31 22.64,35.31 U1.1
RESET  (via drill 0.41)
  Top 0.305: v24.98,31.62 26.42,32.13 U1.29 | C12.1 R1.1 29.69,16.47 29.6,16.38 ICSP.5 29.47,14.73 v28.33,16.76
  Bottom 0.305: v24.98,31.62 23.5,31.62 22.99,31.11 22.99,29.59 25.53,27.05 25.53,25.4 28.33,22.61 v28.33,16.76
SCK  (via drill 0.41)
  Top 0.305: 25.45,24.55 U1.17 | v24.14,23.24 25.45,24.55 | U2.3 14.61,20.32 15.25,20.95 v15.25,23.24 | 25.45,24.55 25.5,24.55 26.7,23.39 27.54,23.39 28.07,22.86 28.07,18.29 27.19,16.89 27.19,14.86 ICSP.3
  Bottom 0.305: v15.25,23.24 v24.14,23.24
USB_D+
  Top 0.305: R8.1 31,46.19 31,45.72 28.2,42.93 22.11,42.93 20.71,41.53 20.71,37.34 21.72,36.32 23.76,36.32 25.03,35.05 25.15,34.94 U1.32
USB_D-
  Top 0.305: R9.1 18.04,46.23 20.2,44.2 20.2,38.99 19.78,38.06 R10.1 19.82,37.85 19.69,37.47 21.34,35.81 23.5,35.81 24.39,34.93 24.39,33.78 22.74,32.13 22.74,29.59 U1.11
VCC  (via drill 0.41)
  Top 0.254: U3.16 22.74,37.47 21.72,37.47 21.47,37.72 v21.42,39.88
  Top 0.305: 11.34,18.64 C4.2 | 11.34,18.64 12.07,17.91 U2.7 | U2.18 C3.2 17.95,18.07 18.3,18.41 v21.47,18.41 | U2.15 15.61,15.26 v16.77,14.1 C2.2 | v10.29,19.68 11.34,18.64 | v18.3,36.58 R10.2 | U1.4 20.64,33.91 v19.44,33.91 19.44,32.89 20.51,31.82 U1.6 | U1.18 24.48,26.67 v24.39,26.67 24.39,29.97 v24.52,30.1 | R6.2 R5.2 34.13,9.31 v34.68,8.76 | R1.2 32.01,12.45 v32.65,11.81 | ICSP.2 24.52,18.92 v25.79,17.65
  Bottom 0.254: v21.42,39.88 18.3,36.7 v18.3,36.58
  Bottom 0.305: v18.3,36.58 18.3,35.31 19.31,34.04 v19.44,33.91 19.44,31.62 v24.39,26.67 24.52,26.54 24.52,25.53 26.55,23.5 26.55,22.48 25.79,21.72 v25.79,17.65 | BATT.1 37.63,5.21 35.19,5.21 34.68,5.71 v34.68,8.76 34.68,11.3 34.17,11.81 v32.65,11.81 30.89,12.83 26.04,12.83 25.79,13.08 v25.79,17.65 | v25.79,17.65 22.23,17.65 v21.47,18.41 | v16.77,14.1 17.15,14.1 v21.47,18.41 | v24.52,30.1 27.68,30.1 BATT.3 | v10.29,19.68 20.2,19.68 v21.47,18.41
(copper drawn outside any net)
  shapes: Bottom area x19, Top circle x3

### Text on the board
tNames: USB | OpenAMD
Reference: 2" | INTERNAL ROUTE | 1" | DO NOT ADD COPPER (RF) | 1" | 2" | 0/0